# EAGLE design OneShot_Relais_Timer_UI (EAGLE 9.6.2)
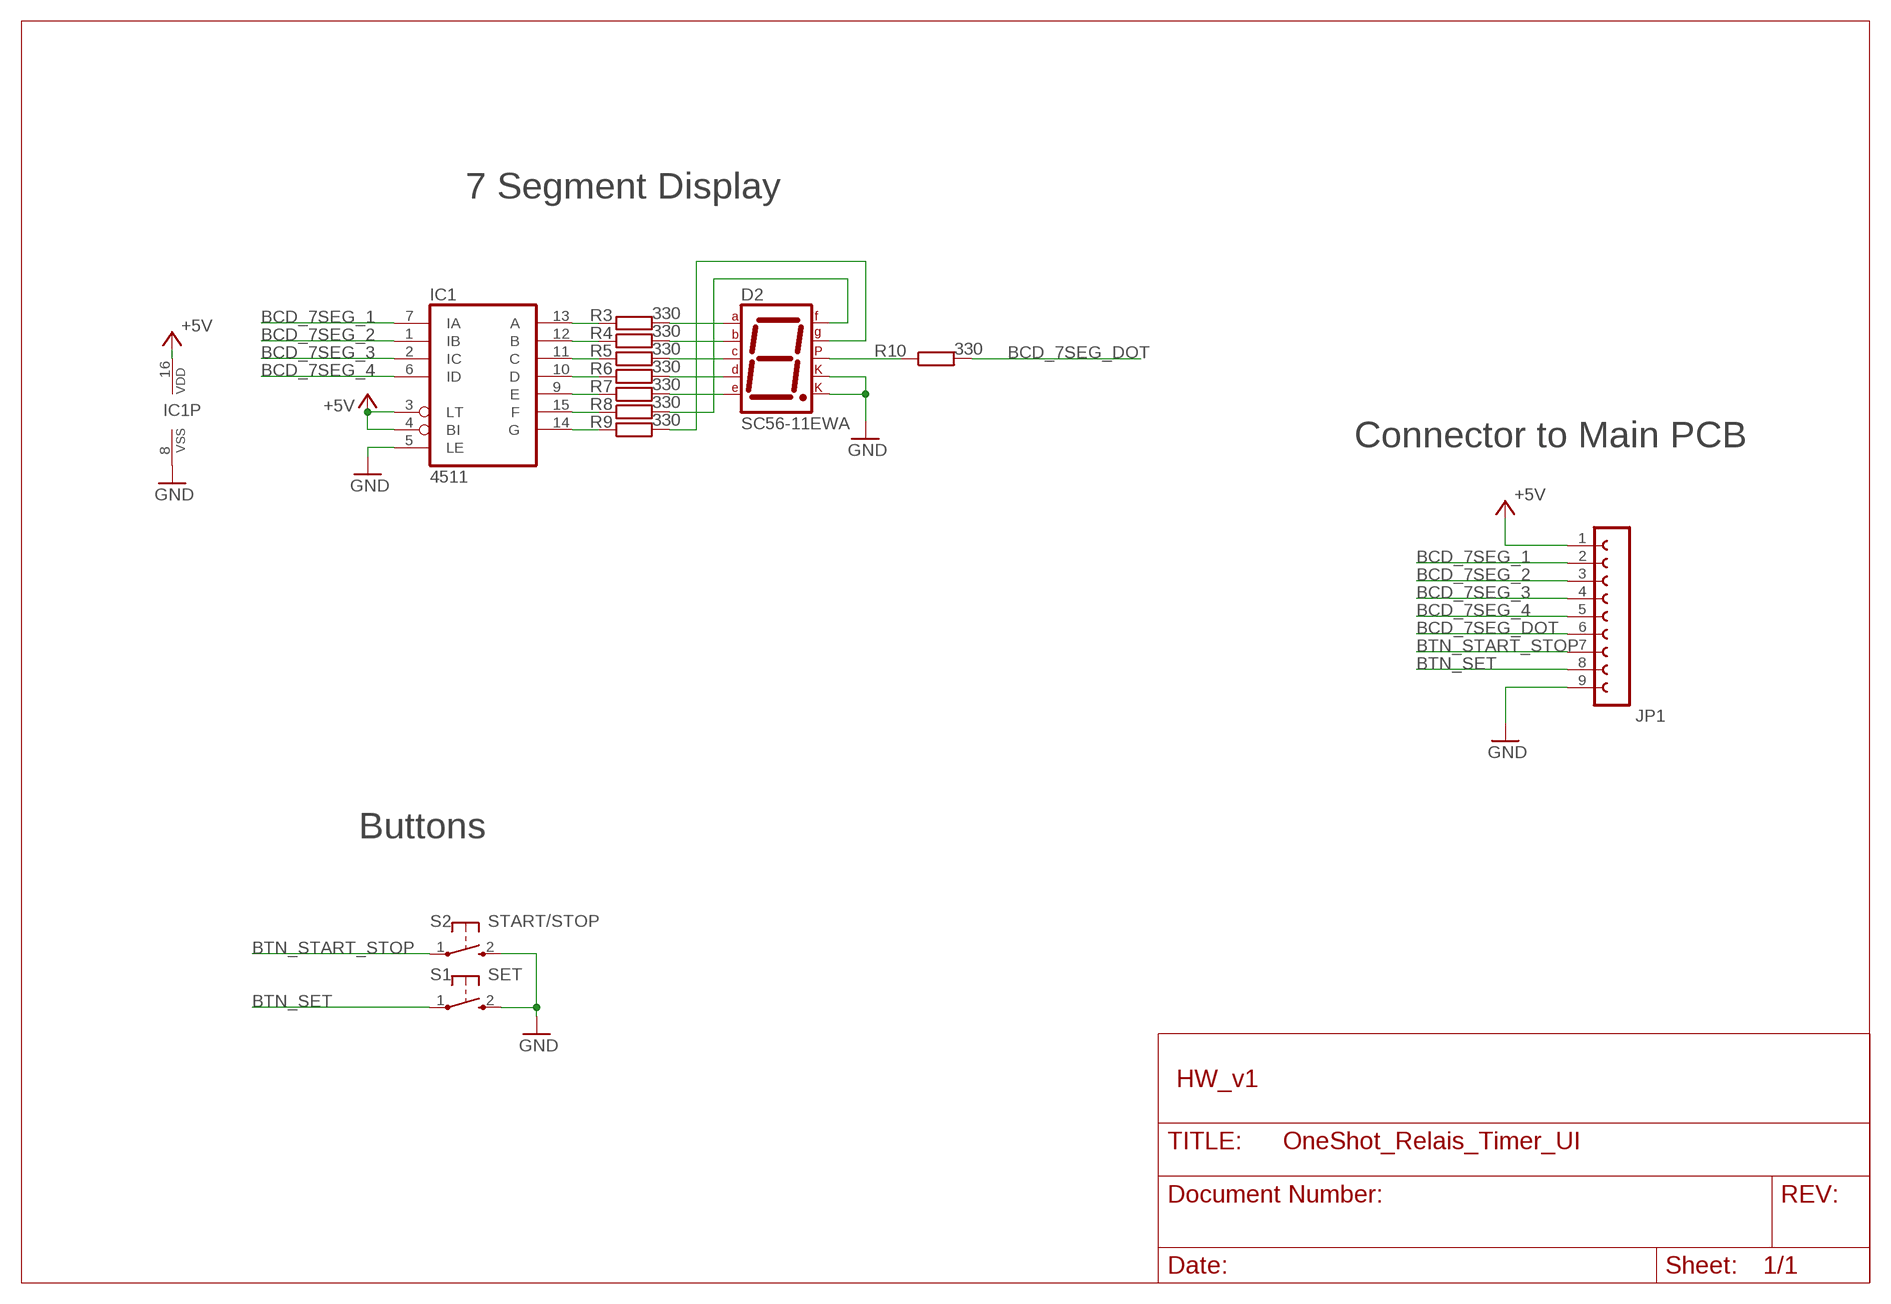
[diagram p0: schematic, sheet 1]

## Parts
D2  SC56-11EWA  7SEG-CK  [7SEG-13]
IC1  4511  [SOIC127P1032X265-16L]
JP1  FE09-1  [FE09]
R3  330  R-EU_R0805  [R0805]
R4  330  R-EU_R0805  [R0805]
R5  330  R-EU_R0805  [R0805]
R6  330  R-EU_R0805  [R0805]
R7  330  R-EU_R0805  [R0805]
R8  330  R-EU_R0805  [R0805]
R9  330  R-EU_R0805  [R0805]
R10  330  R-EU_R0805  [R0805]
S1  SET  KURZHUBTASTER  [B3F-10XX]
S2  START/STOP  KURZHUBTASTER  [B3F-10XX]

## Nets
+5V: IC1.3(LT) IC1.4(BI) IC1.16(VDD) JP1.1
BCD_7SEG_1: IC1.7(IA) JP1.2
BCD_7SEG_2: IC1.1(IB) JP1.3
BCD_7SEG_3: IC1.2(IC) JP1.4
BCD_7SEG_4: IC1.6(ID) JP1.5
BCD_7SEG_DOT: JP1.6 R10.2
BTN_SET: JP1.8 S1.1(P)
BTN_START_STOP: JP1.7 S2.1(P)
GND: D2.3(CK1) D2.8(CK2) IC1.5(LE) IC1.8(VSS) JP1.9 S1.2(S) S2.2(S)
N$1: D2.6(B) R4.2
N$4: IC1.13(A) R3.1
N$5: IC1.12(B) R4.1
N$6: IC1.11(C) R5.1
N$7: IC1.10(D) R6.1
N$8: IC1.9(E) R7.1
N$9: IC1.15(F) R8.1
N$10: IC1.14(G) R9.1
N$11: D2.7(A) R3.2
N$13: D2.4(C) R5.2
N$14: D2.2(D) R6.2
N$15: D2.1(E) R7.2
N$16: D2.9(F) R8.2
N$17: D2.10(G) R9.2
N$19: D2.5(DP) R10.1

## Notes on the sheet
- 7 Segment Display
- Connector to Main PCB
- Buttons
- HW_v1

## Library data of the parts
D2 = special:7SEG-CK: 7-segment DISPLAY single cathode, 13 mm
IC1 = OwnDevices:4511: BCD to 7-segment LATCH/DECODER/DRIVER
JP1 = OwnDevices:FE09-1: FEMALE HEADER; OC_FARNELL: unknown; OC_NEWARK: unknown
R3-R10 = OwnDevices:R-EU_: RESISTOR, European symbol; SPICEPREFIX: R
S1 S2 = OwnDevices:KURZHUBTASTER: OMRON SWITCH

## Board
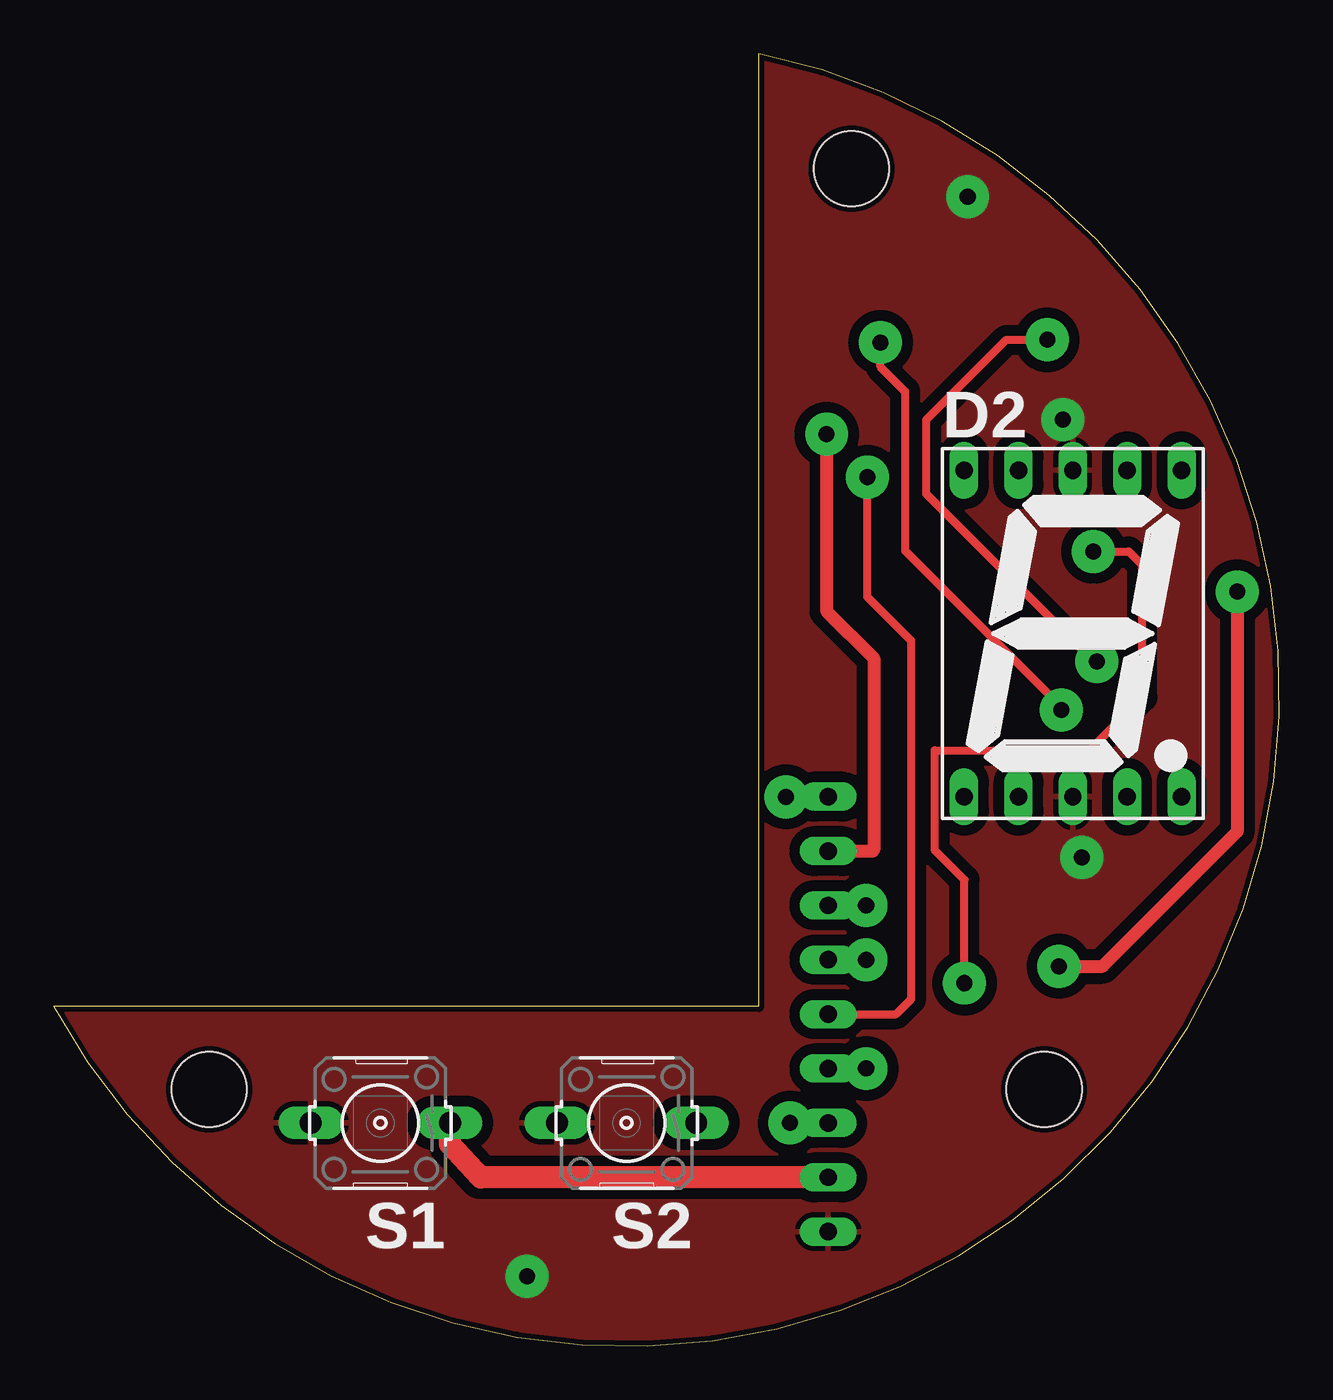
[diagram p1: board, top side]
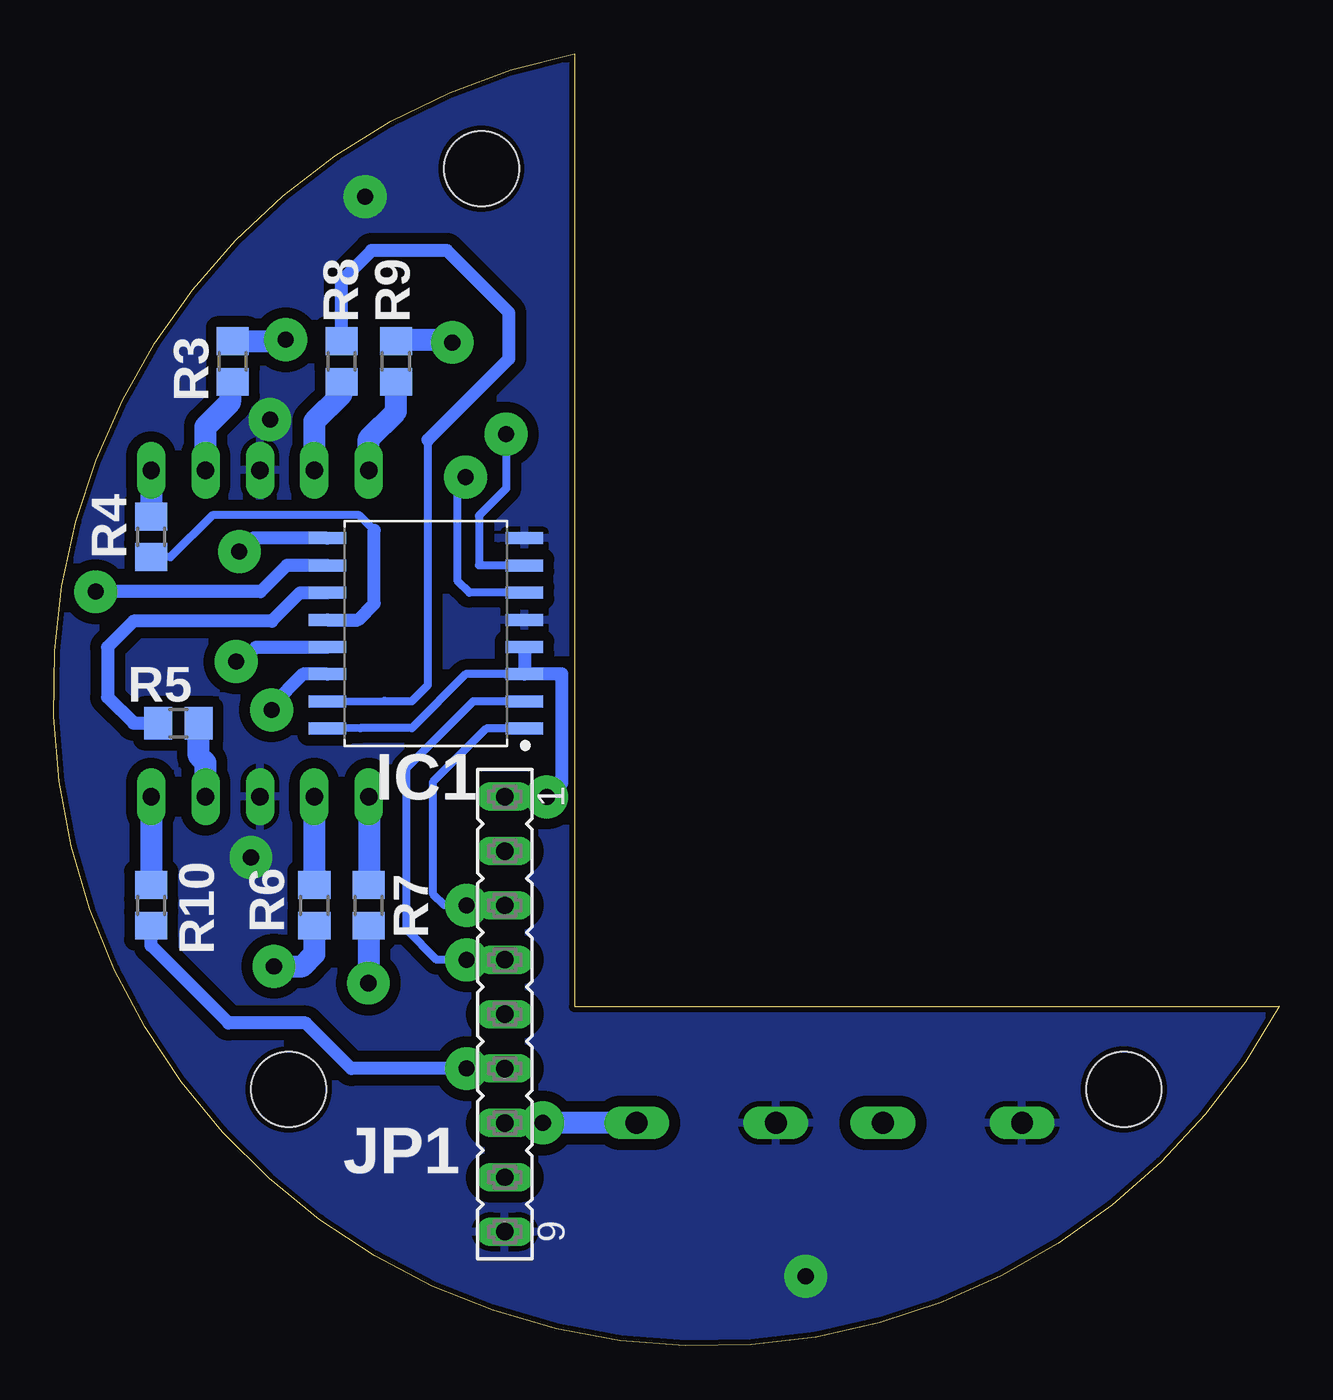
[diagram p2: board, bottom side, seen from below]

Size 57.24 x 60.36 mm. Coordinates in mm from the lower left corner, seen from the top.
Outline: 32.92,60.36 32.92,15.85 0,15.85 arc230 32.92,60.36
Copper layers (1*16): Top 0.035mm / dielectric 1.5mm / Bottom 0.035mm
Design rules "ownDesignRules": minimum track width 15mil, minimum drill 0.5mm, track to track 20mil, track to pad 20mil, pad to pad 6mil, via to via 6mil, smd to smd 6mil, copper to edge 10mil, drill to drill 6mil, minimum pad ring 10mil, minimum via ring 8mil, stop-mask expansion 4mil, vias tented up to drill 0mil, thermal gap 10mil
Holes 3.5 mm at 7.26,11.98 46.26,11.98 37.26,54.98

### Footprints (pad centres in the part's own frame; a part is rotated, then mirrored left to right if it is on the bottom)
7SEG-13 = drill 0.813 long: 1 -5.08,-7.62; 2 -2.54,-7.62; 3 0,-7.62; 4 2.54,-7.62; 5 5.08,-7.62; 6 5.08,7.62; 7 2.54,7.62; 8 0,7.62; 9 -2.54,7.62; 10 -5.08,7.62
SOIC127P1032X265-16L = smd 1.752 x 0.562: 1 -4.604,4.445; 2 -4.604,3.175; 3 -4.604,1.905; 4 -4.604,0.635; 5 -4.604,-0.635; 6 -4.604,-1.905; 7 -4.604,-3.175; 8 -4.604,-4.445; 9 4.604,-4.445; 10 4.604,-3.175; 11 4.604,-1.905; 12 4.604,-0.635; 13 4.604,0.635; 14 4.604,1.905; 15 4.604,3.175; 16 4.604,4.445
FE09 = drill 0.813 long: 1 -10.16,0; 2 -7.62,0; 3 -5.08,0; 4 -2.54,0; 5 0,0; 6 2.54,0; 7 5.08,0; 8 7.62,0; 9 10.16,0
R0805 = smd 1.3 x 1.5: 1 -0.95,0; 2 0.95,0
B3F-10XX = drill 1.016 long: 1 -3.251,0; 2 3.251,0

### Placement (x,y rotation side)
D2  47.6,33.27 0 top
IC1  39.86,33.27 180 bottom
JP1  36.17,15.49 270 bottom
R3  48.87,45.97 270 bottom
R4  52.68,37.78 90 bottom
R5  51.41,29.08 0 bottom
R6  45.06,20.57 90 bottom
R7  42.52,20.57 90 bottom
R8  43.79,45.97 270 bottom
R9  41.25,45.97 270 bottom
R10  52.68,20.57 270 bottom
S1  15.26,10.41 180 top
S2  26.76,10.41 180 top

### Tracks (layer width: path | path; a pad name or v marks a point on that pad's centre or on a via)
+5V  (via drill 0.75 pad 2)
  Top 0.381: v34.21,25.64 34.22,25.65
  Top 1.016: JP1.1 34.22,25.65
  Bottom 0.381: IC1.4 | IC1.3 35.23,31.39 | IC1.3 36.14,31.36 36.13,31.37 IC1.3 | IC1.16 42.92,28.86 40.51,28.86 37.99,31.37 IC1.3
  Bottom 0.61: IC1.4 IC1.3 | 35.23,31.39 33.51,31.39 33.51,26.28 v34.21,25.64
BCD_7SEG_1  (via drill 0.75 pad 2)
  Top 0.61: v36.1,42.58 36.1,34.33 38.31,32.12 38.31,23.17 38.26,23.11 JP1.2
  Bottom 0.381: v36.1,42.58 36.1,40.04 37.37,38.77 37.37,36.45 IC1.7
BCD_7SEG_2  (via drill 0.75 pad 2)
  Top 1.016: JP1.3 v37.95,20.57
  Bottom 0.381: IC1.1 37.04,28.83 39.51,26.36 39.51,21.1 38.99,20.57 v37.95,20.57
BCD_7SEG_3  (via drill 0.75 pad 2)
  Top 1.016: JP1.4 v37.95,18.03
  Bottom 0.381: IC1.2 35.64,30.1 35.65,30.11 37.64,30.11 40.76,26.98 40.76,19.45 39.35,18.03 v37.95,18.03
BCD_7SEG_4  (via drill 0.75 pad 2)
  Top 0.381: v38.01,40.57 38.01,34.98 40.04,32.95 40.04,16.19 39.35,15.49 JP1.5
  Bottom 0.381: v38.01,40.57 38.39,40.19 38.39,35.75 37.82,35.18 IC1.6
BCD_7SEG_DOT  (via drill 0.75 pad 2)
  Top 1.016: JP1.6 v37.95,12.95
  Bottom 0.61: R10.2 52.68,18.7 49.07,15.09 45.47,15.09 43.34,12.95 v37.95,12.95
BTN_SET
  Top 1.016: JP1.8 19.95,7.87 18.51,9.42 S1.1
BTN_START_STOP  (via drill 0.75 pad 2)
  Top 1.016: v34.39,10.41 JP1.7
  Bottom 1.016: S2.1 v34.39,10.41
GND  (via drill 0.75 pad 2)
  other vias: 42.69,53.68 22.12,3.26 47.14,43.26 48.02,22.81
  pour Bottom: -5.86,-1.14 65.76,-1.14 65.76,62.36 -5.86,62.36
  pour Top: -5.86,-1.14 65.76,-1.14 66.02,-0.89 66.02,62.23 65.89,62.36 -5.61,62.36 -5.86,62.1
N$1
  Bottom 1.016: D2.6 R4.2
N$4  (via drill 0.75 pad 2)
  Top 0.381: v46.41,46.99 44.5,46.99 40.76,43.25 40.76,39.79 48.59,31.96 v48.72,31.96
  Bottom 0.61: v48.72,31.96 48.46,31.96 47.78,32.64 IC1.13
  Bottom 1.016: v46.41,46.99 46.47,46.92 R3.1
N$5
  Bottom 0.381: 42.27,38.1 42.97,38.8 49.82,38.8 51.79,36.83 R4.1
  Bottom 0.61: IC1.12 43.03,33.91 42.27,34.67 42.27,38.1
N$6
  Bottom 0.61: IC1.11 45.72,35.18 47.05,33.85 53.5,33.85 54.71,32.64 54.71,30.29 53.51,29.08 R5.1
N$7  (via drill 0.75 pad 2)
  Top 0.61: v46.95,17.73 48.98,17.73 55.28,24.02 v55.28,35.22
  Bottom 0.61: v55.28,35.22 47.57,35.22 46.35,36.45 IC1.10
  Bottom 1.016: R6.1 45.06,18.29 45.62,17.73 v46.95,17.73
N$8  (via drill 0.75 pad 2)
  Top 0.381: v48.56,37.1 50.22,37.1 50.85,36.47 50.85,30.3 48.36,27.81 41.14,27.81 41.14,23.17 42.54,21.77 v42.54,16.94
  Bottom 0.61: v48.56,37.1 47.95,37.72 IC1.9
  Bottom 1.016: R7.1 42.52,16.96 v42.54,16.94
N$9
  Bottom 0.381: 39.76,42.32 39.76,30.86 40.51,30.11 41.77,30.11 41.78,30.12 IC1.15
  Bottom 0.61: R8.1 43.79,49.75 42.39,51.15 38.87,51.15 35.98,48.25 35.98,46.1 39.76,42.32
N$10  (via drill 0.75 pad 2)
  Top 0.381: v38.62,46.87 38.62,45.72 39.76,44.58 39.76,37.14 47.13,29.77 v47.06,29.71
  Bottom 0.381: 41.21,46.97 41.19,46.99
  Bottom 0.61: IC1.14 45.6,31.37 47.06,29.91 v47.06,29.71
  Bottom 1.016: 41.19,46.99 38.75,46.99 v38.62,46.87 | 41.21,46.97 R9.1
N$11
  Bottom 0.381: 49,44.9 R3.2
  Bottom 1.016: 49,44.9 49,44.07 50.14,42.93 D2.7
N$13
  Bottom 1.016: D2.4 50.14,27.24 50.46,27.56 R5.2
N$14
  Bottom 1.016: D2.2 R6.2
N$15
  Bottom 0.381: D2.1 42.51,25.64 | R7.2 42.51,21.54
  Bottom 1.016: 42.51,25.64 42.51,21.54
N$16
  Bottom 1.016: R8.2 43.79,44.45 45.06,43.18 D2.9
N$17
  Bottom 1.016: D2.10 42.52,42.37 41.25,43.64 R9.2
N$19
  Bottom 1.016: D2.5 R10.1